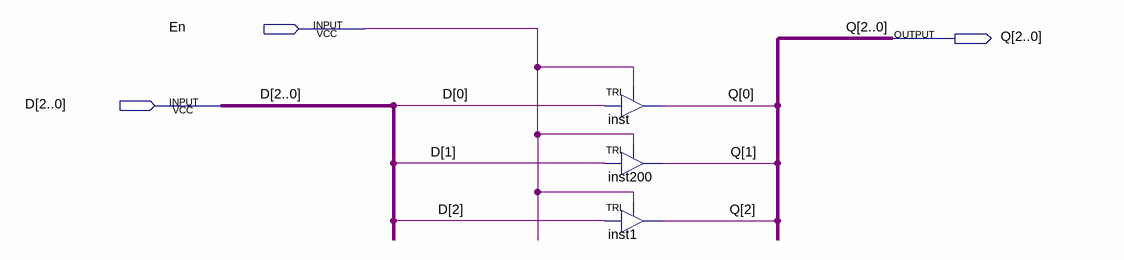
[diagram p0: schematic sheet]
// Quartus schematic 3_bit_tri.bdf as structural Verilog: 3 symbols, 3 pins
module \3_bit_tri  (
  input  En,
  input  [2:0] D,
  output [2:0] Q
);

  TRI inst (.IN(D[0]), .OE(En), .OUT(Q[0]));
  TRI inst200 (.IN(D[1]), .OE(En), .OUT(Q[1]));
  TRI inst1 (.IN(D[2]), .OE(En), .OUT(Q[2]));
endmodule
